# EAGLE design SDI12_Interface (EAGLE 9.6.2)
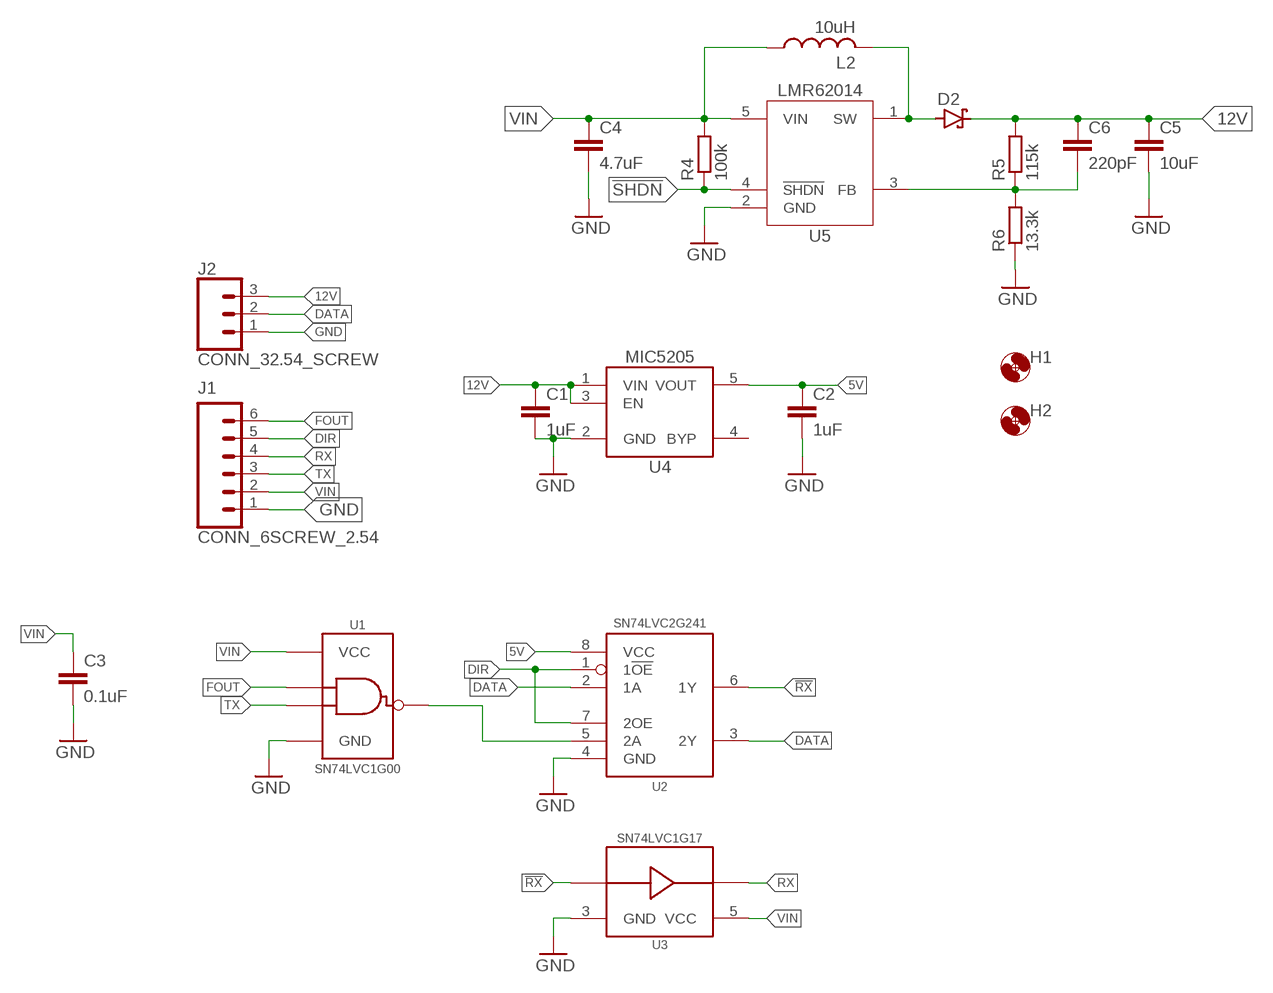
[diagram p0: schematic, sheet 1]

## Parts
C1  1uF  C-EU1UFC0603  [C0603]
C2  1uF  C-EU1UFC0603  [C0603]
C3  0.1uF  C-EU0.1UFC0603  [C0603]
C4  4.7uF  C-EU4.7UFC0805  [C0805]
C5  10uF  C-EU10UFC0805  [C0805]
C6  220pF  C-EU220PFC0603  [C0603]
D2  DIODE_SCHOTTKYSOD-123  [SOD-123]
H1  MOUNTING_HOLE2_NP  [2_56]
H2  MOUNTING_HOLE2_NP  [2_56]
J1  CONN_6SCREW_2.54  [1X06_SCREW]
J2  CONN_32.54_SCREW  [1X03_SCREW]
L2  10uH  INDUCTOR1008  [1008]
R4  100k  R-EU_100KR0603  [R0603]
R5  115k  R-EU_115KR0603  [R0603]
R6  13.3k  R-EU_13.3KR0603  [R0603]
U1  SN74LVC1G00SC70  [DCK_R-PDSO-G5]
U2  SN74LVC2G241DCU  [DCU_(R-PDSO-G8)]
U3  SN74LVC1G17DCK  [DCK_R-PDSO-G5]
U4  MIC5205_5V  [SOT23-5]
U5  LMR62014SOT23  [DBV0005A]

## Nets
5V: C2.1 U2.8(VCC) U4.5(VOUT)
12V: C1.1 C5.1 C6.1 D2.CAT(C) J2.3 R5.2 U4.1(VIN) U4.3(EN)
!RX: U2.6(1Y) U3.2(A)
!SHDN: R4.1 U5.4(!SHDN)
DATA: J2.2 U2.2(1A) U2.3(2Y)
DIR: J1.5 U2.1(1!OE) U2.7(2OE)
FOUT: J1.6 U1.1(A)
GND: C1.2 C2.2 C3.2 C4.2 C5.2 J1.1 J2.1 R6.1 U1.3(GND) U2.4(GND) U3.3(GND) U4.2(GND) U5.2(GND)
N$1: U1.4(Y) U2.5(2A)
N$4: C6.2 R5.1 R6.2 U5.3(FB)
RX: J1.4 U3.4(Y)
SW1: D2.ANODE(A) L2.2 U5.1(SW)
TX: J1.3 U1.2(B)
VIN: C3.1 C4.1 J1.2 L2.1 R4.2 U1.5(VCC) U3.5(VCC) U5.5(VIN)

## Power pins joined to a net without a drawn wire
BYP: U4.4(BYP)

## Library data of the parts
C1 C2 = bschulz_passives:C-EU: CAPACITOR, European symbol; DIGIKEY: 587-1251-1-ND; MF: Yaiyo Yuden; MPN: EMK107BJ105KA-T
C3 = bschulz_passives:C-EU: CAPACITOR, European symbol; DIGIKEY: 490-6051-1-ND; MF: Murata; MPN: GCM188R71E104KA57D
C4 = bschulz_passives:C-EU: CAPACITOR, European symbol; DIGIKEY: 399-7415-1-ND; MF: Kemet; MPN: C0805C475K4RACTU
C5 = bschulz_passives:C-EU: CAPACITOR, European symbol; DIGIKEY: 587-2985-1-ND; MF: Taiyo Yuden; MPN: TMK212BBJ106KG-T
C6 = bschulz_passives:C-EU: CAPACITOR, European symbol; DIGIKEY: 399-1066-1-ND; MF: Kemet; MPN: C0603C221J5GACTU
D2 = bschulz:DIODE_SCHOTTKY: Generic Shottky Diode; DIGIKEY: MBR0520LT1GOSCT-ND; MF: ON Semiconductor; MPN: MBR0520LT1G
H1 H2 = bschulz:MOUNTING_HOLE: Genaric Mechanical Mounting Hole Hole diameter based on max body diameter + 15% Keepout ring is for diameter of socket cap screw (minimum required clearance) TPlace ring is for diameter of pan head screw (recomended clearance) Specifications: Socket Cap <http://fastener-express.com/fastener-technical/SocketscapSS-Alloy.pdf> Button Head Socket Cap <http://fastener-express.com/fastener-technical/Button-Socket-alloy.pdf> Pan Head <http://fastener-express.com/fastener-technical/pan-machine-Screws.pdf>; DIGIKEY: DNP; MF: N/A; MPN: DNP
J1 = bschulz:CONN_6: Genaric 6 terminal header Digikey 2.54_SCREW <https://www.digikey.com/product-detail/en/on-shore-technology-inc/OSTVN06A150/ED10565-ND/1588866>; DIGIKEY: ED10565-ND; MF: OnShore; MPN: OSTVN06A150
J2 = bschulz:CONN_3: Genaric 3 terminal header Digikey 2.54_SCREW <https://www.digikey.com/product-detail/en/on-shore-technology-inc/OSTVN03A150/ED10562-ND/1588863> 3.5_SCREW <https://www.digikey.com/product-detail/en/on-shore-technology-inc/OSTTE030161/ED2636-ND/614585>; DIGIKEY: ED10562-ND; MF: On Shore; MPN: OSTVN03A150
L2 = bschulz:INDUCTOR: Genaric inductor; DIGIKEY: 732-4851-1-ND; MF: Wurth; MPN: 74438323100
R4 = bschulz_passives:R-EU_: RESISTOR, European symbol Digikey Parts: Yageo, 0402 <https://www.digikey.com/products/en/resistors/chip-resistor-surface-mount/52?k=&pkeyword=&sv=0&s=4356&sf=1&FV=-1%7C13%2C7%7C2%2C1291%7C39157%2C1989%7C0%2C-8%7C52%2C3%7C1131%2C3%7C2503&quantity=&ColumnSort=0&page=1&stock=1&pageSize=25> Yageo, 0603 <https://www.digikey.com/products/en/resistors/chip-resistor-surface-mount/52?k=&pkeyword=&sv=0&pv1291=39245&sf=1&FV=-5%7C4356%2C-5%7C47360%2C-8%7C52%2C-1%7C13%2C7%7C2%2C1989%7C0&quantity=10&ColumnSort=1000011&page=1&stock=1&pageSize=25> Panasonic, 0603 <https://www.digikey.com/products/en/resistors/chip-resistor-surface-mount/52?k=&pkeyword=&pv252=68&sf=0&FV=ffec373d%2C1c0002%2C142c040c%2C1f140000%2Cffe00034%2C80002%2Cc0001&quantity=&ColumnSort=0&page=1&stock=1&pageSize=25> Panasonic, precision, 0603 <https://www.digikey.com/products/en/resistors/chip-resistor-surface-mount/52?FV=ffec4907%2Cfffc000a%2Cc0172%2C142c040c%2C1f140000%2Cffe00034%2C1c0002&quantity=100&ColumnSort=2085&page=1&stock=1&pageSize=25> Panasonic, 0805 <https://www.digikey.com/products/en/resistors/chip-resistor-surface-mount/52?k=&pkeyword=&pv3=1&sf=0&FV=ffec373d%2C1c0002%2C1f140000%2Cffe00034%2C142c040d&quantity=&ColumnSort=0&page=1&stock=1&pageSize=25> Rohm, current sense <https://www.digikey.com/products/en/resistors/chip-resistor-surface-mount/52?k=&pkeyword=&pv3=1&sf=0&FV=ffecb688%2C1f140000%2Cffe00034%2C1c0002&quantity=&ColumnSort=0&page=1&stock=1&pageSize=25> Vishay, pulse proof automotive <https://www.digikey.com/products/en/resistors/chip-resistor-surface-mount/52?k=&pkeyword=&pv7=2&sf=0&FV=ffec5d6b%2Cffe00034%2C1f140000&quantity=&ColumnSort=0&page=1&stock=1&pageSize=25>; DIGIKEY: 311-100KHRCT-ND; MF: Yageo; MPN: RC0603FR-07100KL; VALUE_PART: 100k
R5 = bschulz_passives:R-EU_: RESISTOR, European symbol Digikey Parts: Yageo, 0402 <https://www.digikey.com/products/en/resistors/chip-resistor-surface-mount/52?k=&pkeyword=&sv=0&s=4356&sf=1&FV=-1%7C13%2C7%7C2%2C1291%7C39157%2C1989%7C0%2C-8%7C52%2C3%7C1131%2C3%7C2503&quantity=&ColumnSort=0&page=1&stock=1&pageSize=25> Yageo, 0603 <https://www.digikey.com/products/en/resistors/chip-resistor-surface-mount/52?k=&pkeyword=&sv=0&pv1291=39245&sf=1&FV=-5%7C4356%2C-5%7C47360%2C-8%7C52%2C-1%7C13%2C7%7C2%2C1989%7C0&quantity=10&ColumnSort=1000011&page=1&stock=1&pageSize=25> Panasonic, 0603 <https://www.digikey.com/products/en/resistors/chip-resistor-surface-mount/52?k=&pkeyword=&pv252=68&sf=0&FV=ffec373d%2C1c0002%2C142c040c%2C1f140000%2Cffe00034%2C80002%2Cc0001&quantity=&ColumnSort=0&page=1&stock=1&pageSize=25> Panasonic, precision, 0603 <https://www.digikey.com/products/en/resistors/chip-resistor-surface-mount/52?FV=ffec4907%2Cfffc000a%2Cc0172%2C142c040c%2C1f140000%2Cffe00034%2C1c0002&quantity=100&ColumnSort=2085&page=1&stock=1&pageSize=25> Panasonic, 0805 <https://www.digikey.com/products/en/resistors/chip-resistor-surface-mount/52?k=&pkeyword=&pv3=1&sf=0&FV=ffec373d%2C1c0002%2C1f140000%2Cffe00034%2C142c040d&quantity=&ColumnSort=0&page=1&stock=1&pageSize=25> Rohm, current sense <https://www.digikey.com/products/en/resistors/chip-resistor-surface-mount/52?k=&pkeyword=&pv3=1&sf=0&FV=ffecb688%2C1f140000%2Cffe00034%2C1c0002&quantity=&ColumnSort=0&page=1&stock=1&pageSize=25> Vishay, pulse proof automotive <https://www.digikey.com/products/en/resistors/chip-resistor-surface-mount/52?k=&pkeyword=&pv7=2&sf=0&FV=ffec5d6b%2Cffe00034%2C1f140000&quantity=&ColumnSort=0&page=1&stock=1&pageSize=25>; DIGIKEY: 311-115KHRCT-ND; MF: Yageo; MPN: RC0603FR-07115KL; VALUE_PART: 115k
R6 = bschulz_passives:R-EU_: RESISTOR, European symbol Digikey Parts: Yageo, 0402 <https://www.digikey.com/products/en/resistors/chip-resistor-surface-mount/52?k=&pkeyword=&sv=0&s=4356&sf=1&FV=-1%7C13%2C7%7C2%2C1291%7C39157%2C1989%7C0%2C-8%7C52%2C3%7C1131%2C3%7C2503&quantity=&ColumnSort=0&page=1&stock=1&pageSize=25> Yageo, 0603 <https://www.digikey.com/products/en/resistors/chip-resistor-surface-mount/52?k=&pkeyword=&sv=0&pv1291=39245&sf=1&FV=-5%7C4356%2C-5%7C47360%2C-8%7C52%2C-1%7C13%2C7%7C2%2C1989%7C0&quantity=10&ColumnSort=1000011&page=1&stock=1&pageSize=25> Panasonic, 0603 <https://www.digikey.com/products/en/resistors/chip-resistor-surface-mount/52?k=&pkeyword=&pv252=68&sf=0&FV=ffec373d%2C1c0002%2C142c040c%2C1f140000%2Cffe00034%2C80002%2Cc0001&quantity=&ColumnSort=0&page=1&stock=1&pageSize=25> Panasonic, precision, 0603 <https://www.digikey.com/products/en/resistors/chip-resistor-surface-mount/52?FV=ffec4907%2Cfffc000a%2Cc0172%2C142c040c%2C1f140000%2Cffe00034%2C1c0002&quantity=100&ColumnSort=2085&page=1&stock=1&pageSize=25> Panasonic, 0805 <https://www.digikey.com/products/en/resistors/chip-resistor-surface-mount/52?k=&pkeyword=&pv3=1&sf=0&FV=ffec373d%2C1c0002%2C1f140000%2Cffe00034%2C142c040d&quantity=&ColumnSort=0&page=1&stock=1&pageSize=25> Rohm, current sense <https://www.digikey.com/products/en/resistors/chip-resistor-surface-mount/52?k=&pkeyword=&pv3=1&sf=0&FV=ffecb688%2C1f140000%2Cffe00034%2C1c0002&quantity=&ColumnSort=0&page=1&stock=1&pageSize=25> Vishay, pulse proof automotive <https://www.digikey.com/products/en/resistors/chip-resistor-surface-mount/52?k=&pkeyword=&pv7=2&sf=0&FV=ffec5d6b%2Cffe00034%2C1f140000&quantity=&ColumnSort=0&page=1&stock=1&pageSize=25>; DIGIKEY: 311-13.3KHRCT-ND; MF: Yageo; MPN: RC0603FR-0713K3L; VALUE_PART: 13.3k
U1 = bschulz:SN74LVC1G00; DIGIKEY: 296-9846-1-ND; DISP: SN74LVC1G00; MPN: SN74LVC1G00DCKR
U2 = bschulz:SN74LVC2G241: SN74LVC2G241 - Dual Buffer and Driver with 3-State Outputs Characteristics: VCC: 1.65~5.5V Operating Temperature: -40°C to 85°C Number of Bits: 2 /li> Inverting: No 5V Tolerent Input (Down Shift) Digikey: 296-32323-1-ND (VSSOP, DCU) <https://www.digikey.com/en/products/detail/texas-instruments/SN74LVC2G241DCUT/1592289>; DIGIKEY: 296-32323-1-ND; MF: TI; MPN: SN74LVC2G241DCUT
U3 = bschulz:SN74LVC1G17: SN74LVC1G17 - Single Schmitt Trigger Logic Buffer Characteristics: VCC: 1.65~5.5V Operating Temperature: -40°C to 125°C Number of Gates: 1 /li> Inverting: No 5V Tolerent Input (Down Shift) Digikey: 296-11934-1-ND (SC70, DCK) <https://www.digikey.com/product-detail/en/texas-instruments/SN74LVC1G17DCKR/296-11934-1-ND/389052>; DIGIKEY: 296-11934-1-ND; DISP: SN74LVC1G17; MF: TI; MPN: SN74LVC1G17DCKR
U4 = bschulz:MIC5205: MIC5205 - Low Power, High Performance, Linear Regulator Characteristics: Vin: 2.5V ~ 16V Vout: Many options, (1v ~ 3.3v) see datasheet <http://ww1.microchip.com/downloads/en/DeviceDoc/20005785A.pdf> IQ: 80μA typ Dropout Voltage: 110mV @ 50mA Voltage Accuracy: 1% typ Output Current: 150 mA Operating Temperature: -40°C to 125°C Digikey: 576-1259-1-ND (3.3V Fixed) <https://www.digikey.com/product-detail/en/microchip-technology/MIC5205-3.3YM5-TR/576-1259-1-ND/771886> 576-1261-1-ND (5V Fixed) <https://www.digikey.com/en/products/detail/microchip-technology/MIC5205-5-0YM5-TR/771730?s=N4IgjCBcoCwdIDGUBmBDANgZwKYBoQB7KAbRAGYYB2GciAXQIAcAXKEAZRYCcBLAOwDmIAL4EwVKgE4ooZJHTZ8RUiABMMKRIbM2kTjwHCxIALRrZSKDwCuy4pDIz6IkxccgAtr0QBWNQAMviAuQA>; DIGIKEY: 576-1261-1-ND; MF: Microchip; MPN: MIC5205-5.0YM5-TR
U5 = bschulz:LMR62014: LMR62014 - Step-Up Boost Regulator Characteristics: Vin: 2.7V ~ 14V Vout: Vin ~ 20V Output Current (max): 1.4A IQ: 2mA (switching), 0.4mA (not switching), 24nA (shutdown) (typ) Operating Temperature: -40°C to 125°C Digikey: LMR62014XMF/NOPBCT-ND <https://www.digikey.com/product-detail/en/texas-instruments/LMR62014XMF-NOPB/LMR62014XMF-NOPBCT-ND/3527344>; DIGIKEY: LMR62014XMF/NOPBCT-ND; DISP: LMR62014; MF: TI; MPN: LMR62014XMF/NOPB

## Board
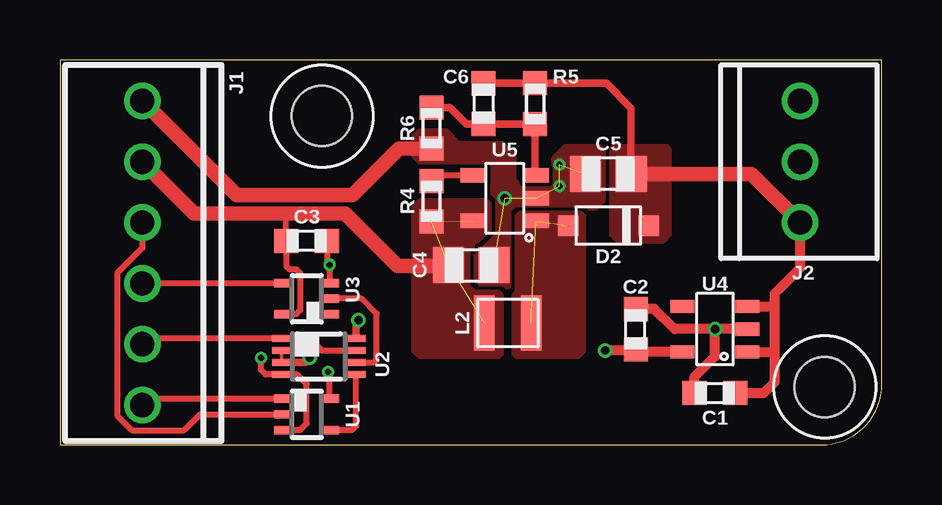
[diagram p1: board, top side]
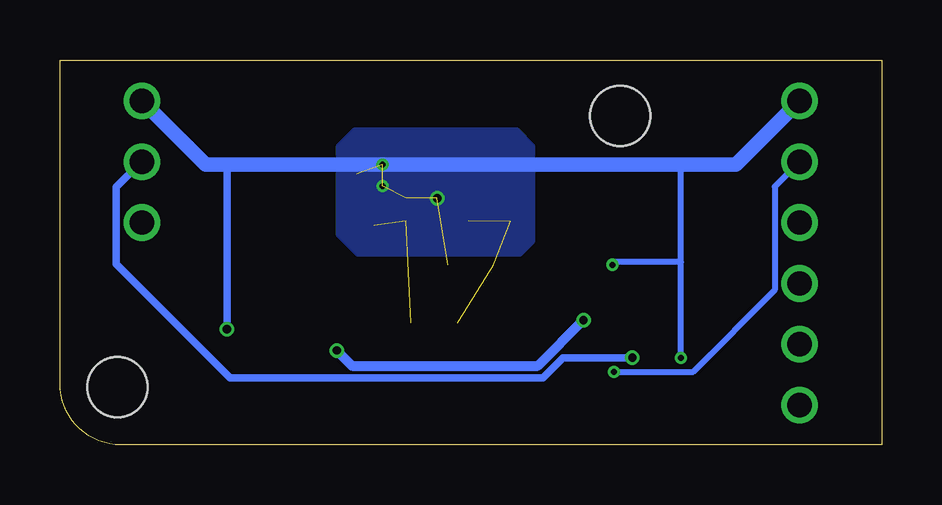
[diagram p2: board, bottom side, seen from below]

Size 34.27 x 16.05 mm. Coordinates in mm from the lower left corner, seen from the top.
Outline: 0,0 31.73,0 arc90 34.27,2.54 34.27,16.05 0,16.05 0,0
Copper layers (1*16): Top 0.035559375mm / dielectric 1.6mm / Bottom 0.035559375mm
Design rules "oshpark-2layer": minimum track width 6mil, minimum drill 10mil, track to track 6mil, track to pad 6mil, pad to pad 6mil, via to via 6mil, smd to smd 6mil, copper to edge 15mil, drill to drill 6mil, minimum pad ring 5mil, minimum via ring 5mil, stop-mask expansion 2.5mil, vias tented up to drill 0mil, thermal gap 10mil

### Footprints (pad centres in the part's own frame; a part is rotated, then mirrored left to right if it is on the bottom)
C0603 = smd 1 x 1: 1 -0.85,0; 2 0.85,0
C0805 = smd 1.3 x 1.5: 1 -0.95,0; 2 0.95,0
SOD-123 = smd 0.85 x 0.85: ANODE 1.675,0; CAT -1.675,0
2_56 = hole 2.5: 0,0
1X06_SCREW = drill 1.016: 1 -6.35,0; 2 -3.81,0; 3 -1.27,0; 4 1.27,0; 5 3.81,0; 6 6.35,0
1X03_SCREW = drill 1.016: 1 -2.54,0; 2 0,0; 3 2.54,0
1008 = smd 0.85 x 2.3: 1 -0.975,0; 2 0.975,0
R0603 = smd 1 x 1: 1 -0.85,0; 2 0.85,0
DCK_R-PDSO-G5 = smd 0.35 x 0.8: 1 -0.65,-0.95; 2 0,-0.95; 3 0.65,-0.95; 4 0.65,0.95; 5 -0.65,0.95
DCU_(R-PDSO-G8) = smd 0.3 x 0.8: 1 -0.75,-1.55; 2 -0.25,-1.55; 3 0.25,-1.55; 4 0.75,-1.55; 5 0.75,1.55; 6 0.25,1.55; 7 -0.25,1.55; 8 -0.75,1.55
SOT23-5 = smd 0.55 x 1: 1 -0.95,-1.35; 2 0,-1.35; 3 0.95,-1.35; 4 0.95,1.35; 5 -0.95,1.35
DBV0005A = smd 1.1 x 0.6: 1 -1.3,0.95; 2 -1.3,0; 3 -1.3,-0.95; 4 1.3,-0.95; 5 1.3,0.95

### Placement (x,y rotation side)
C1  27.3,2.16 180 top
C2  24,4.83 90 top
C3  10.29,8.51 0 top
C4  17.14,7.49 0 top
C5  22.86,11.3 180 top
C6  17.65,14.22 270 top
D2  22.86,9.14 180 top
H1  10.92,13.72 0 top
H2  31.88,2.41 0 top
J1  3.43,8 270 top
J2  30.86,11.81 270 top
L2  18.67,5.08 0 top
R4  15.49,10.16 270 top
R5  19.81,14.22 90 top
R6  15.49,13.21 90 top
U1  10.29,1.27 270 top
U2  10.79,3.68 270 top
U3  10.29,6.1 90 top
U4  27.3,4.83 90 top
U5  18.54,10.29 180 top

### Tracks (layer width: path | path; a pad name or v marks a point on that pad's centre or on a via)
5V  (via drill 0.35)
  Top 0.305: v12.45,5.21 12.35,5.11 U2.8
  Top 0.406: U4.5 24.1,3.88 C2.1 23.96,3.94 v22.73,3.94
  Bottom 0.406: v22.73,3.94 22.1,3.3 14.35,3.3 v12.45,5.21
12V
  Top 0.305: C6.1 R5.2 22.77,15.07 23.81,14.04 C5.1
  Top 0.406: C1.1 29.34,2.16 29.79,2.61 29.79,3.94 | 29.79,5.84 29.79,6.29 30.86,7.37 J2.3 | 29.79,5.84 29.79,3.94 | U4.1 29.73,3.88 29.79,3.94 | U4.3 29.72,5.78 29.79,5.84
  Top 0.61: C5.1 28.83,11.3 J2.3
  pour Top (no thermals): 22.99,12.32 22.99,8.76 23.24,8.51 25.15,8.51 25.4,8.76 25.4,12.32 25.27,12.45 23.11,12.45
!RX
  Top 0.254: U2.6 13.09,3.43 13.21,3.56 13.21,5.46 12.57,6.1 U3.2
!SHDN
  Top 0.254: U5.4 15.72,11.24 R4.1
DATA  (via drill 0.35)
  Top 0.152: U2.3 U2.2
  Top 0.305: U2.3 10.21,3.43 v10.41,3.63
  Bottom 0.305: v10.41,3.63 13.3,3.63 14.14,2.79 27.18,2.79 31.93,7.54 31.93,10.74 J2.2
DIR
  Top 0.254: U2.7 10.93,3.93 10.43,4.43 U2.1 9.23,4.45 3.68,4.45 J1.5
FOUT
  Top 0.254: U1.1 3.7,1.92 J1.6
GND  (via drill 0.25, 0.35)  (5 unrouted)
  Top 0.254: U1.3 10.02,0.62 10.29,0.89 10.29,2.54 9.89,2.93 U2.4 8.57,2.93 8.38,3.12 v8.38,3.63 | 11.22,6.73 U3.3 v11.24,7.51 11.14,7.61 C3.2
  Top 0.406: U4.2 v27.3,4.83 | C1.2 26.45,2.83 27.3,3.68 v27.3,4.83 | v27.3,4.83 25.61,4.83 24.77,5.68 C2.2
  Top 0.61: R6.1 14.14,12.36 12.19,10.41 7.37,10.41 J1.1
  Bottom 0.254: v8.38,3.63 8.38,7.62 | 3.43,14.1 J1.1 | 8.38,7.62 11.12,7.62 v11.24,7.51 | 8.38,7.62 8.38,11.68
  Bottom 0.305: v27.3,4.83 27.3,11.68
  Bottom 0.61: J2.1 28.19,11.68 27.3,11.68 v20.83,11.68 8.38,11.68 6.1,11.68 J1.1
  other vias: 20.83,10.79 18.54,10.29
  pour Top (rank 2, no thermals): 17.27,6.6 18.8,6.6 18.92,6.73 18.92,9.53 19.3,9.91 22.35,9.91 22.73,10.29 22.73,12.19 22.48,12.45 21.08,12.45 20.57,11.94 20.57,10.92 20.45,10.79 19.18,10.79 18.92,11.05 18.92,12.06 18.41,12.57 16.64,12.57 16.13,13.08 14.99,13.08 14.73,12.83 14.73,12.06 14.99,11.81 17.78,11.81 18.03,11.56 18.03,8.89 17.14,8 17.14,6.73
  pour Bottom: 14.61,12.45 15.24,13.08 21.97,13.08 22.61,12.45 22.61,8.76 21.84,8 15.11,8 14.61,8.51
N$1
  Top 0.152: U1.4 11.29,0.62
  Top 0.254: U1.4 12.18,0.62 12.35,0.79 U2.5
N$4
  Top 0.305: R6.2 16.26,14.06 16.94,13.37 C6.2 R5.1 19.81,11.27 U5.3
RX
  Top 0.254: J1.4 8.13,6.73 8.14,6.75 U3.4
SW1  (2 unrouted)
  pour Top (no thermals): 19.05,9.53 19.05,6.35 18.92,6.22 18.92,3.81 19.05,3.68 21.59,3.68 21.84,3.94 21.84,9.53 21.72,9.65 19.18,9.65
TX
  Top 0.254: J1.3 3.43,8.2 2.39,7.16 2.39,1.22 3,0.61 5.18,0.61 5.84,1.27 U1.2
VIN  (via drill 0.25)  (3 unrouted)
  Top 0.254: U3.5 9.85,5.45 10.02,5.62 10.02,7.16 9.85,7.33 9.56,7.33 9.44,7.45 C3.1 9.44,9.56 9.53,9.65 | U1.5 11.24,2.99 v11.18,3.05
  Top 0.61: C4.1 16.17,7.46 14.08,7.46 11.89,9.65 9.53,9.65 5.59,9.65 J1.2
  Bottom 0.254: v11.18,3.05 7.87,3.05 4.47,6.45 4.47,10.77 J1.2
  pour Top (no thermals): 17.78,10.16 14.99,10.16 14.73,9.91 14.73,3.94 14.99,3.68 18.29,3.68 18.41,3.81 18.41,6.22 18.29,6.35 17.27,6.35 17.02,6.6 17.02,8.13 17.91,9.02 17.91,10.03

### Text on the board
tDocu: GND | GND | VIN | DATA | TX | 12V | RX | DIR | Fout | SDI-12 Interface / v0.0 / B. Schulz